# Altium schematic sheet 2.POWER.SchDoc
size A4; DocumentNumber: 3; SheetNumber: 3; SheetTotal: 6
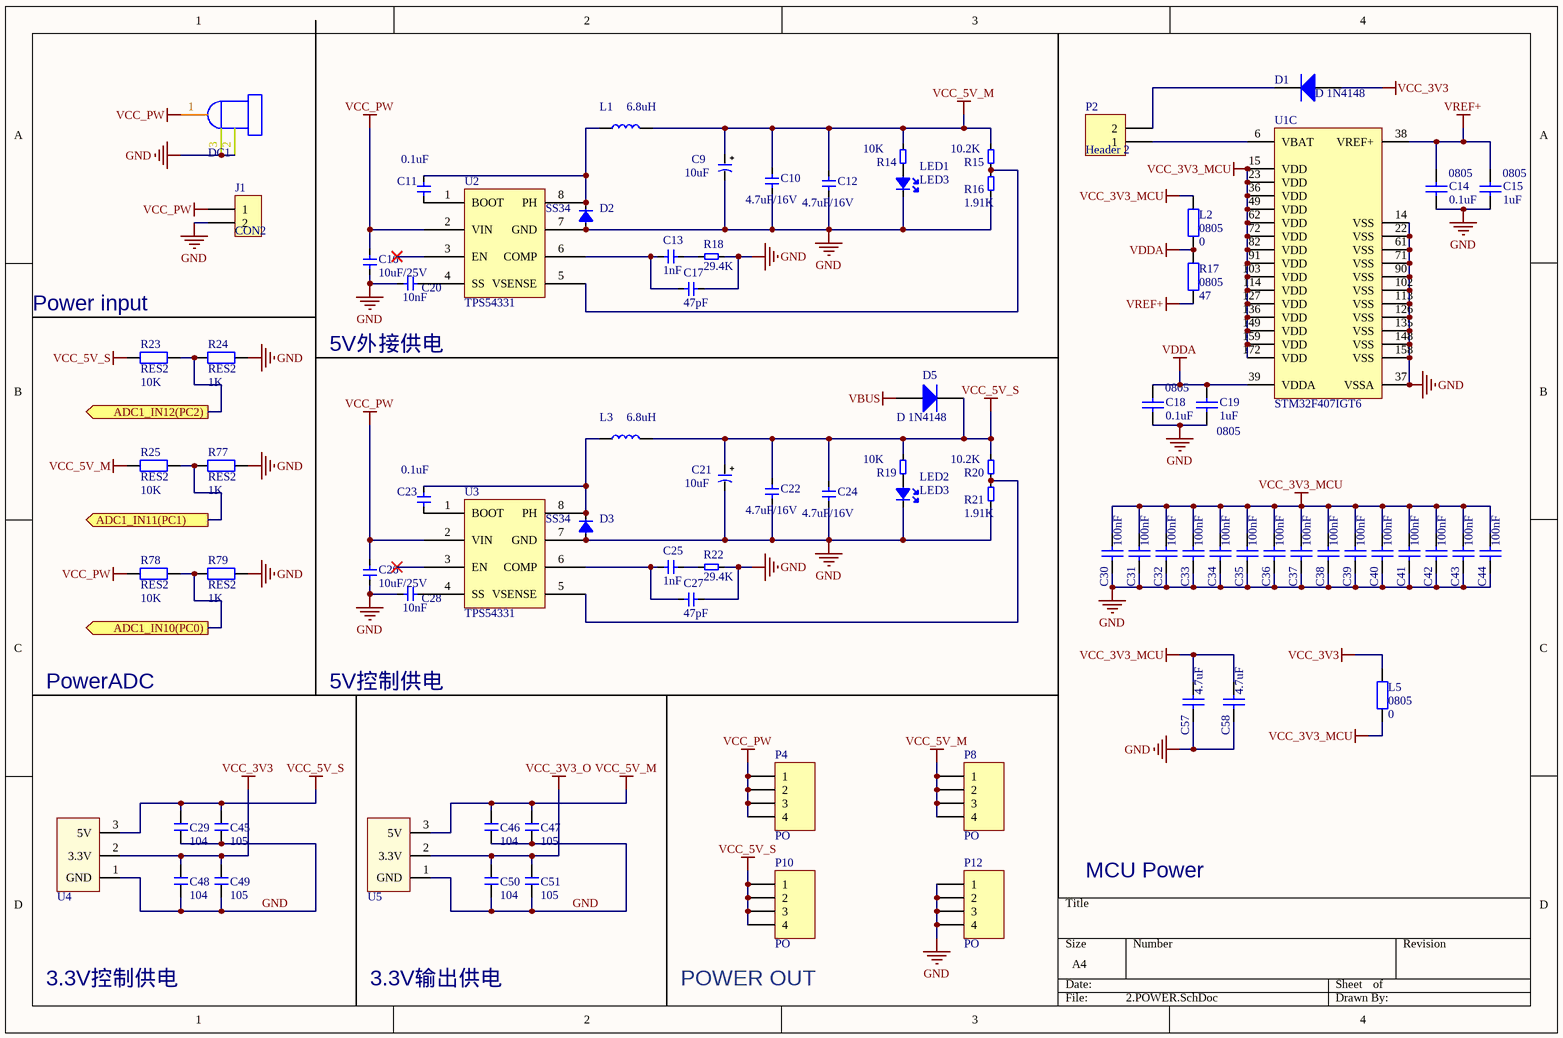
[diagram p0: 2.POWER.SchDoc]

## Parts
C9  10uF  [3528]
C10  4.7uF/16V  [0603C]
C11  0.1uF  [0603C]
C12  4.7uF/16V  [0603C]
C13  1nF  [0603C]
C14  0805  value 0.1uF  [C 0603_L]
C15  0805  value 1uF  [C 0603_L]
C16  10uF/25V  [1206]
C17  47pF  [0603C]
C18  0805  value 0.1uF  [C 0603_L]
C19  0805  value 1uF  [C 0603_L]
C20  10nF  [0603C]
C21  10uF  [3528]
C22  4.7uF/16V  [0603C]
C23  0.1uF  [0603C]
C24  4.7uF/16V  [0603C]
C25  1nF  [0603C]
C26  10uF/25V  [1206]
C27  47pF  [0603C]
C28  10nF  [0603C]
C29  104  [C 0805]
C30  value 100nF  [C 0603_L]  (hidden comment: 0805)
C31  value 100nF  [C 0603_L]  (hidden comment: 0805)
C32  value 100nF  [C 0603_L]  (hidden comment: 0805)
C33  value 100nF  [C 0603_L]  (hidden comment: 0805)
C34  value 100nF  [C 0603_L]  (hidden comment: 0805)
C35  value 100nF  [C 0603_L]  (hidden comment: 0805)
C36  value 100nF  [C 0603_L]  (hidden comment: 0805)
C37  value 100nF  [C 0603_L]  (hidden comment: 0805)
C38  value 100nF  [C 0603_L]  (hidden comment: 0805)
C39  value 100nF  [C 0603_L]  (hidden comment: 0805)
C40  value 100nF  [C 0603_L]  (hidden comment: 0805)
C41  value 100nF  [C 0603_L]  (hidden comment: 0805)
C42  value 100nF  [C 0603_L]  (hidden comment: 0805)
C43  value 100nF  [C 0603_L]  (hidden comment: 0805)
C44  value 100nF  [C 0603_L]  (hidden comment: 0805)
C45  105  [C 0805]
C46  104  [C 0805]
C47  105  [C 0805]
C48  104  [C 0805]
C49  105  [C 0805]
C50  104  [C 0805]
C51  105  [C 0805]
C57  value 4.7uF  [C 0805_M]  (hidden comment: 0805)
C58  value 4.7uF  [C 0805_M]  (hidden comment: 0805)
D1  D 1N4148  [SOD-523]
D2  SS34  [DO-214AC-SMA]
D3  SS34  [DO-214AC-SMA]
D5  D 1N4148  [SOD-123]
DC1  DC  [DC-005]  (value not drawn)
J1  CON2  [DG1282-5.0]
L1  6.8uH  [L100]
L2  0805  value 0  [R 0402_L]
L3  6.8uH  [L100]
L5  0805  value 0  [R 0805_L]
LED1  LED3  [0603-led]
LED2  LED3  [0603-led]
P2  Header 2  [HDR2.54-LI-2P]
P4  PO  [KF2EDGK-2.54-WI-4P]
P8  PO  [KF2EDGK-2.54-WI-4P]
P10  PO  [KF2EDGK-2.54-WI-4P]
P12  PO  [KF2EDGK-2.54-WI-4P]
R14  10K  [0603]
R15  10.2K  [0603]
R16  1.91K  [0603]
R17  0805  value 47  [R 0402_L]
R18  29.4K  [0603]
R19  10K  [0603]
R20  10.2K  [0603]
R21  1.91K  [0603]
R22  29.4K  [0603]
R23  RES2  value 10K  [R 0805_L]
R24  RES2  value 1K  [R 0805_L]
R25  RES2  value 10K  [R 0805_L]
R77  RES2  value 1K  [R 0805_L]
R78  RES2  value 10K  [R 0805_L]
R79  RES2  value 1K  [R 0805_L]
U1  STM32F407IGT6  [STM-LQFP176_N]  (part C of 3)
U2  TPS54331  [SO08]
U3  TPS54331  [SO08]
U4  LM1117  [SOT223]  (value not drawn)
U5  LM1117  [SOT223]  (value not drawn)

## Ports
ADC1_IN10(PC0) (out), ADC1_IN11(PC1) (out), ADC1_IN12(PC2) (out)

## Nets
GND: C9.2 C10.1 C12.1 C14.1 C15.1 C16.1 C17.2 C18.1 C19.1 C20.2 C21.2 C22.1 C24.1 C26.1 C27.2 C28.2 C29.1 C30.1 C31.1 C32.1 C33.1 C34.1 C35.1 C36.1 C37.1 C38.1 C39.1 C40.1 C41.1 C42.1 C43.1 C44.1 C45.2 C46.1 C47.2 C48.1 C49.2 C50.1 C51.2 C57.1 C58.1 D2.1(A) D3.1(A) DC1.2(-) DC1.3(-) J1.2 LED1.2(K) LED2.2(K) P12.1 P12.2 P12.3 P12.4 R16.1 R18.1 R21.1 R22.1 R24.1 R77.1 R79.1 U1.14(VSS) U1.22(VSS) U1.37(VSSA) U1.61(VSS) U1.71(VSS) U1.90(VSS) U1.102(VSS) U1.113(VSS) U1.126(VSS) U1.135(VSS) U1.148(VSS) U1.158(VSS) U2.7(GND) U3.7(GND) U4.1(GND) U5.1(GND)
VBUS: D5.1(A)
VCC_3V3: C48.2 C49.1 D1.1(A) L5.2 U4.2(3.3V)
VCC_3V3_MCU: C30.2 C31.2 C32.2 C33.2 C34.2 C35.2 C36.2 C37.2 C38.2 C39.2 C40.2 C41.2 C42.2 C43.2 C44.2 C57.2 C58.2 L2.2 L5.1 U1.15(VDD) U1.23(VDD) U1.36(VDD) U1.49(VDD) U1.62(VDD) U1.72(VDD) U1.82(VDD) U1.91(VDD) U1.103(VDD) U1.114(VDD) U1.127(VDD) U1.136(VDD) U1.149(VDD) U1.159(VDD) U1.172(VDD)
VCC_3V3_O: C50.2 C51.1 U5.2(3.3V)
VCC_5V_M: C9.1 C10.2 C12.2 C46.2 C47.1 L1.1 P8.1 P8.2 P8.3 P8.4 R14.2 R15.2 R25.2 U5.3(5V)
VCC_5V_S: C21.1 C22.2 C24.2 C29.2 C45.1 D5.2(K) L3.1 P10.1 P10.2 P10.3 P10.4 R19.2 R20.2 R23.2 U4.3(5V)
VCC_PW: C16.2 C26.2 DC1.1(+) J1.1 P4.1 P4.2 P4.3 P4.4 R78.2 U2.2(VIN) U3.2(VIN)
VDDA: C18.2 C19.2 L2.1 R17.2 U1.39(VDDA)
VREF+: C14.2 C15.2 R17.1 U1.38(VREF+)
ADC1_IN10(PC0): R78.1 R79.2 ; port ADC1_IN10(PC0)
ADC1_IN11(PC1): R25.1 R77.2 ; port ADC1_IN11(PC1)
ADC1_IN12(PC2): R23.1 R24.2 ; port ADC1_IN12(PC2)
NetC11_1: C11.1 U2.1(BOOT)
NetC11_2: C11.2 D2.2(K) L1.2 U2.8(PH)
NetC13_1: C13.1 R18.2
NetC13_2: C13.2 C17.1 U2.6(COMP)
NetC20_1: C20.1 U2.4(SS)
NetC23_1: C23.1 U3.1(BOOT)
NetC23_2: C23.2 D3.2(K) L3.2 U3.8(PH)
NetC25_1: C25.1 R22.2
NetC25_2: C25.2 C27.1 U3.6(COMP)
NetC28_1: C28.1 U3.4(SS)
NetD1_2: D1.2(K) P2.2
NetLED1_1: LED1.1(A) R14.1
NetLED2_1: LED2.1(A) R19.1
NetP2_1: P2.1 U1.6(VBAT)
NetR15_1: R15.1 R16.2 U2.5(VSENSE)
NetR20_1: R20.1 R21.2 U3.5(VSENSE)

Not connected (* = marked no-connect by the designer): U2 3(EN)*; U3 3(EN)*

## Notes on the sheet
- (near R23) Power input
- 5V外接供电
- PowerADC
- 5V控制供电
- MCU Power
- 3.3V控制供电
- 3.3V输出供电
- (near P10) POWER OUT
- (in symbol CAP-+) +

## Library data of the parts
C9 C21 = CAP-+: Capacitor
C10 C12 C16 C17 C20 C22 C24 C26-C28 = CAP1: Capacitor
C11 C13 C23 C25 = CAP1: Capacitor; 类型: 电容
C14 C15 C18 C19 C30-C44 C57 C58 = CAP
C29 C45-C51 = C: 无极性贴片电容; 版权归属: 源创客; BOM名称: 无极性贴片电容; 学习资源: www.ooocke.com
D1 D5 = D 1N4148: High Conductance Fast Diode; Published: 8-Jun-2000; LatestRevisionDate: 17-Jul-2002; LatestRevisionNote: Re-released for DXP Platform.; DatasheetVersion: 1997; PackageReference: DO-35; Publisher: Altium Limited; PackageDescription: Diode, Axial; Body 3.8 x 1.9 mm (LxDia. max), Lead Dia. 0.53 mm (max); Code_JEDEC: DO-204-AH; ComponentLink1Description: Manufacturer Link; ComponentLink1URL: http://www.fairchildsemi.com/; ComponentLink2Description: Datasheet; ComponentLink2URL: http://www.fairchildsemi.com/ds/1N%2F1N4148.pdf
D2 D3 = DIOLED_1: DIODE LED
L1 L3 = INDUCTOR1_1
L2 L5 R17 R23-R25 R77-R79 = RES2: Resistor; Published: 8-Jun-2000; LatestRevisionDate: 17-Jul-2002; LatestRevisionNote: Re-released for DXP Platform.; PackageReference: AXIAL-0.3; Publisher: Altium Limited; PackageDescription: Axial Device, Thru-Hole; 2 Leads; 0.3 in Pin Spacing
LED1 LED2 = CP_DIOLED: DIODE LED
P2 = Header 2: Header, 2-Pin; LatestRevisionDate: 17-Jul-2002; LatestRevisionNote: Re-released for DXP Platform.; Publisher: Altium Limited
P4 P8 P10 P12 = Header 4: Header, 4-Pin; LatestRevisionDate: 17-Jul-2002; LatestRevisionNote: Re-released for DXP Platform.; Publisher: Altium Limited
R14-R16 R18-R22 = RES2
U1 = STM32F407IGT6: ARM Cortex-M4 32-bit MCU+FPU, 210 DMIPS, 1024 kB Flash, 192 kB Internal RAM, 140 I/Os, 176-pin LQFP, -40 to 85 degC, Tray; Manufacturer: STMicroelectronics; D/A Converter: 2x12-bit; FLASH Size (Prog) (kB): 1024; I/Os (High Current): 140; Internal RAM Size (kB): 192; Operating Frequency(F) (Processor speed) (MHz): 168; Supply Voltage(Vcc) max (V): 3.6; Supply Voltage(Vcc) min (V): 1.8; DatasheetVersion: Rev. 4; PackageVersion: Rev. 4, 06/2013; PackageReference: LQFP176; PackageDescription: 176-Pin Low Profile Quad Flat Package, 24 x 24 mm Body, 0.5 mm Pitch; Supplier 1: Digi-Key; Supplier Part Number 1: 497-11604-ND; Supplier 2: Farnell; Supplier Part Number 2: 2064366; Supplier 3: Newark; Supplier Part Number 3: 73T2331; Supplier 4: Mouser; Supplier Part Number 4: 511-STM32F407IGT6; Core: ARM Cortex-M4; Packing: Tray; Mounting Technology: Surface Mount; PartNumber: STM32F407IGT6; ComponentLink1Description: Manufacturer URL; ComponentLink1URL: http://www.st.com/web/en/home.html; ComponentLink2Description: Datasheet; ComponentLink2URL: http://www.st.com/st-web-ui/static/active/en/resource/technical/document/datasheet/DM00037051.pdf; ComponentLink3Description: Package Specification; ComponentLink3URL: http://www.st.com/st-web-ui/static/active/en/resource/technical/document/datasheet/DM00035129.pdf